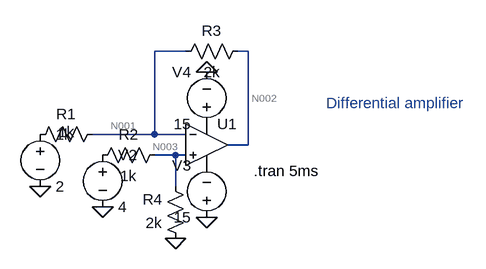
[diagram p0: schematic differential amp.asc]
differential amp.asc, the LTspice schematic file:
Version 4
SHEET 1 880 680
WIRE 160 16 112 16
WIRE 256 16 240 16
WIRE 112 144 112 16
WIRE 112 144 16 144
WIRE 160 144 112 144
WIRE 256 160 256 16
WIRE 256 160 224 160
WIRE 144 176 112 176
WIRE 160 176 144 176
WIRE 144 224 144 176
FLAG 192 48 0
FLAG 192 272 0
FLAG 144 304 0
FLAG 32 256 0
FLAG -64 224 0
SYMBOL Opamps\\UniversalOpamp2 192 160 R0
SYMATTR InstName U1
SYMBOL res 32 128 R90
WINDOW 0 0 56 VBottom 2
WINDOW 3 28 56 VBottom 2
SYMATTR InstName R1
SYMATTR Value 1k
SYMBOL res 128 160 R90
WINDOW 0 0 56 VBottom 2
WINDOW 3 32 56 VTop 2
SYMATTR InstName R2
SYMATTR Value 1k
SYMBOL res 256 0 R90
WINDOW 0 0 56 VBottom 2
WINDOW 3 32 56 VTop 2
SYMATTR InstName R3
SYMATTR Value 2k
SYMBOL res 160 320 R180
WINDOW 0 36 76 Left 2
WINDOW 3 36 40 Left 2
SYMATTR InstName R4
SYMATTR Value 2k
SYMBOL voltage -64 128 R0
WINDOW 123 0 0 Left 0
WINDOW 39 0 0 Left 0
SYMATTR InstName 1k
SYMATTR Value 2
SYMBOL voltage 32 160 R0
WINDOW 123 0 0 Left 0
WINDOW 39 0 0 Left 0
SYMATTR InstName V2
SYMATTR Value 4
SYMBOL voltage 192 288 R180
WINDOW 0 24 96 Left 2
WINDOW 3 24 16 Left 2
WINDOW 123 0 0 Left 0
WINDOW 39 0 0 Left 0
SYMATTR InstName V3
SYMATTR Value 15
SYMBOL voltage 192 144 R180
WINDOW 0 24 96 Left 2
WINDOW 3 24 16 Left 2
WINDOW 123 0 0 Left 0
WINDOW 39 0 0 Left 0
SYMATTR InstName V4
SYMATTR Value 15
TEXT 264 200 Left 2 !.tran 5ms
TEXT 376 96 Left 2 ;Differential amplifier

The netlist it stands for:
* differential amp.asc
XU1 N003 N001 P001 P002 N002 level.2 Avol=1Meg GBW=10Meg Slew=10Meg ilimit=25m rail=0 Vos=0 phimargin=45 en=0 enk=0 in=0 ink=0 Rin=500Meg  ; pins IN+ IN- V+ V- OUT
R1 N001 P003 1k
R2 N003 P004 1k
R3 N002 N001 2k
R4 0 N003 2k
V§1k P003 0 2
V2 P004 0 4
V3 0 P002 15
V4 P001 0 15
.tran 5ms
* Differential amplifier
.lib UniversalOpamps2.sub
.backanno
.end

* Results of the author's LTspice run, read from the files saved beside the schematic
* Operating Point, zero values left out:
*   V(n002) = 4 V
*   V(p001) = 15 V
*   V(p002) = -15 V
*   V(n001) = 2.667 V
*   V(n003) = 2.667 V
*   V(p003) = 2 V
*   V(p004) = 4 V
*   I(R4) = -1.333 mA
*   I(R3) = 666.7 µA
*   I(R2) = -1.333 mA
*   I(R1) = 666.7 µA
*   I(V4) = -1.815 mA
*   I(V3) = -1.149 mA
*   I(V2) = -1.333 mA
*   I(1k) = 666.7 µA
*   Ix(u1:1) = 5.333 nA
*   Ix(u1:2) = 5.333 nA
*   Ix(u1:3) = 1.815 mA
*   Ix(u1:4) = -1.149 mA
*   Ix(u1:5) = -666.7 µA